# Altium schematic sheet Top.SchDoc: Test
size A4; DrawnBy: Łukasz Przeniosło; Organization: Zachodniopomorski; Address1: Uniwersytet Technologiczny; Address2: w Szczecinie; Address3: Wydział Elektryczny; DocumentNumber: 1111; Revision: 1.0; SheetNumber: 0; SheetTotal: 0
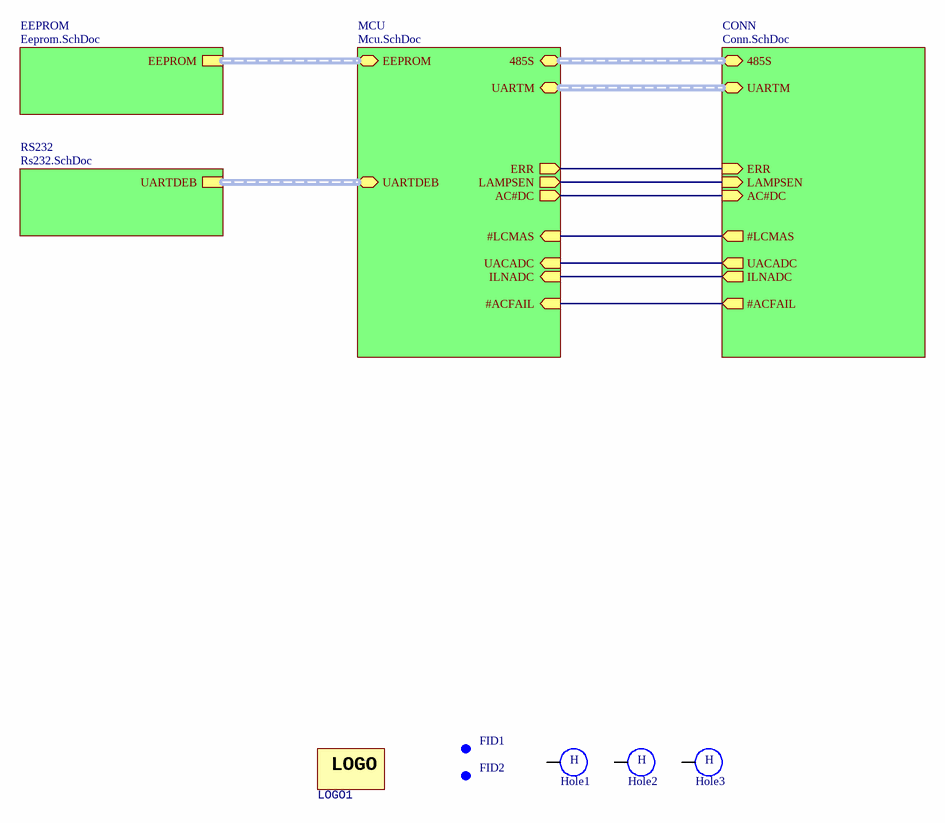
[diagram p0: Top.SchDoc]

## Parts
FID1  Fiducial  [Fid Round]  (value not drawn)  (no BOM)
FID2  Fiducial  [Fid Round]  (value not drawn)  (no BOM)
Hole1  Hole  [HOLE-6/3.2]  (value not drawn)
Hole2  Hole  [HOLE-6/3.2]  (value not drawn)
Hole3  Hole  [HOLE-6/3.2]  (value not drawn)
LOGO1  Logo  [LOGO_BEMKO]  (value not drawn)

## Sub-sheets
CONN = Conn.SchDoc: UACADC (out), ILNADC (out), #LCMAS (out), #ACFAIL (out), ERR (in), UARTM (harness UARTM), 485S (harness 485S), LAMPSEN (in), AC#DC (in)
EEPROM = Eeprom.SchDoc: EEPROM (harness EEPROM)
MCU = Mcu.SchDoc: UACADC (in), ILNADC (in), #ACFAIL (in), ERR (out), LAMPSEN (out), AC#DC (out), 485S (harness 485S), UARTM (harness UARTM), #LCMAS (in), EEPROM (harness EEPROM), UARTDEB
RS232 = Rs232.SchDoc: UARTDEB (harness UARTDEB)

## Nets
(unnamed): sheet MCU/UACADC, sheet CONN/UACADC
(unnamed): sheet MCU/ILNADC, sheet CONN/ILNADC
(unnamed): sheet MCU/#ACFAIL, sheet CONN/#ACFAIL
(unnamed): sheet MCU/ERR, sheet CONN/ERR
(unnamed): sheet MCU/LAMPSEN, sheet CONN/LAMPSEN
(unnamed): sheet MCU/AC#DC, sheet CONN/AC#DC
(unnamed): sheet MCU/#LCMAS, sheet CONN/#LCMAS

Not connected (* = marked no-connect by the designer): Hole1 1; Hole2 1; Hole3 1

## Buses and harness runs
harness sheet CONN/485S = sheet MCU/485S
harness sheet CONN/UARTM = sheet MCU/UARTM
harness sheet EEPROM/EEPROM = sheet MCU/EEPROM
harness sheet MCU/UARTDEB = sheet RS232/UARTDEB

## Notes on the sheet
- Title
- Size:
- Date:
- A4
- Author:
- Time:
- Sheet
- of
- File:
- (in symbol HOLE_) H
- (in symbol Logo) LOGO

## Library data of the parts
FID1 FID2 = FID ROUND: round fiducial
Hole1-Hole3 = HOLE_